# Altium schematic sheet Solenoid Current Detector.SchDoc
size A4
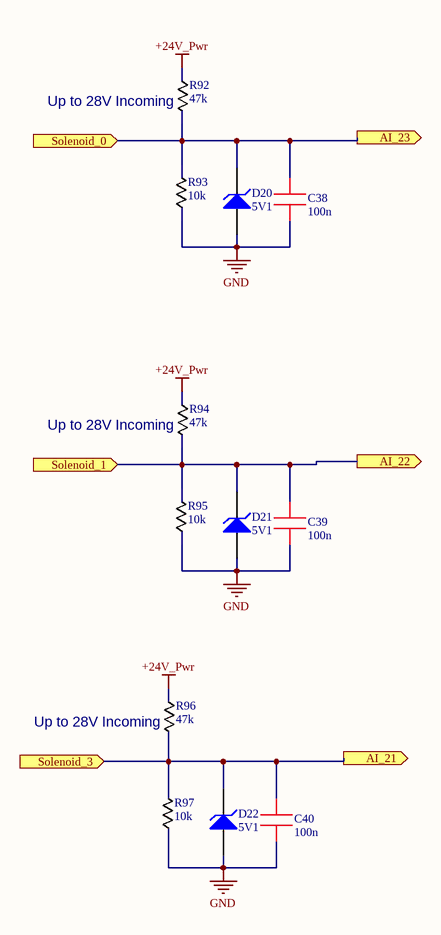
[diagram p0: Solenoid Current Detector.SchDoc]

## Parts
C38  100n  [0603]
C39  100n  [0603]
C40  100n  [0603]
D20  5V1  [SOT23]
D21  5V1  [SOT23]
D22  5V1  [SOT23]
R92  47k  [0603]
R93  10k  [0603]
R94  47k  [0603]
R95  10k  [0603]
R96  47k  [0603]
R97  10k  [0603]

## Ports
AI_21, AI_22, AI_23, Solenoid_0, Solenoid_1, Solenoid_3

## Nets
+24V_Pwr: R92.1 R94.1 R96.1
GND: C38.1 C39.1 C40.1 D20.1(A) D21.1(A) D22.1(A) R93.1 R95.1 R97.1
AI_21: C40.2 D22.2(K) R96.2 R97.2 ; port Solenoid_3, port AI_21
AI_22: C39.2 D21.2(K) R94.2 R95.2 ; port Solenoid_1, port AI_22
AI_23: C38.2 D20.2(K) R92.2 R93.2 ; port Solenoid_0, port AI_23

## Notes on the sheet
- (near R92) Up to 28V Incoming
- (near R94) Up to 28V Incoming
- (near R96) Up to 28V Incoming

## Library data of the parts
C38-C40 = 0603 CAP: CC0603KRX7R9BB104
D20-D22 = D Zener: BZX84C5V1LT1G
R92 R94 R96 = 0603 RES: RC0603JR-0747K
R93 R95 R97 = 0603 RES: RT0603FRE0710KL